# Altium schematic sheet WallLightRemote_V1.0_HMI.SchDoc: WallLight Remote
size A4; PageSetup: Record=PageOptions|CenterHorizontal=True|CenterVertical=True|PrintScale=0.97|XCorrection=1.00|YCorrection=1.00|PrintKind=0|BorderSize=5000000|LeftOffset=0|BottomOffset=0|Orientation=2|PaperLength=1000|PaperWidth=1000|Scale=100|PaperSource=7|PrintQuality=-3|MediaType=1|DitherType=10|PrintScaleMode=1|PaperKind=A4|PaperIndex=9; Organization: Crelin; Address1: Karl-Neuhaus-Strasse 6, 2502 Biel; Address2: Florian Baumgartner; Address3: florian.b-h@bluewin.ch; Address4: Tel: (+41) 32-323 56 25 / (+41) 79-502 92 10; DocumentNumber: HMI; Revision: V1.0; SheetNumber: 5; SheetTotal: 5; Author: Florian Baumgartner
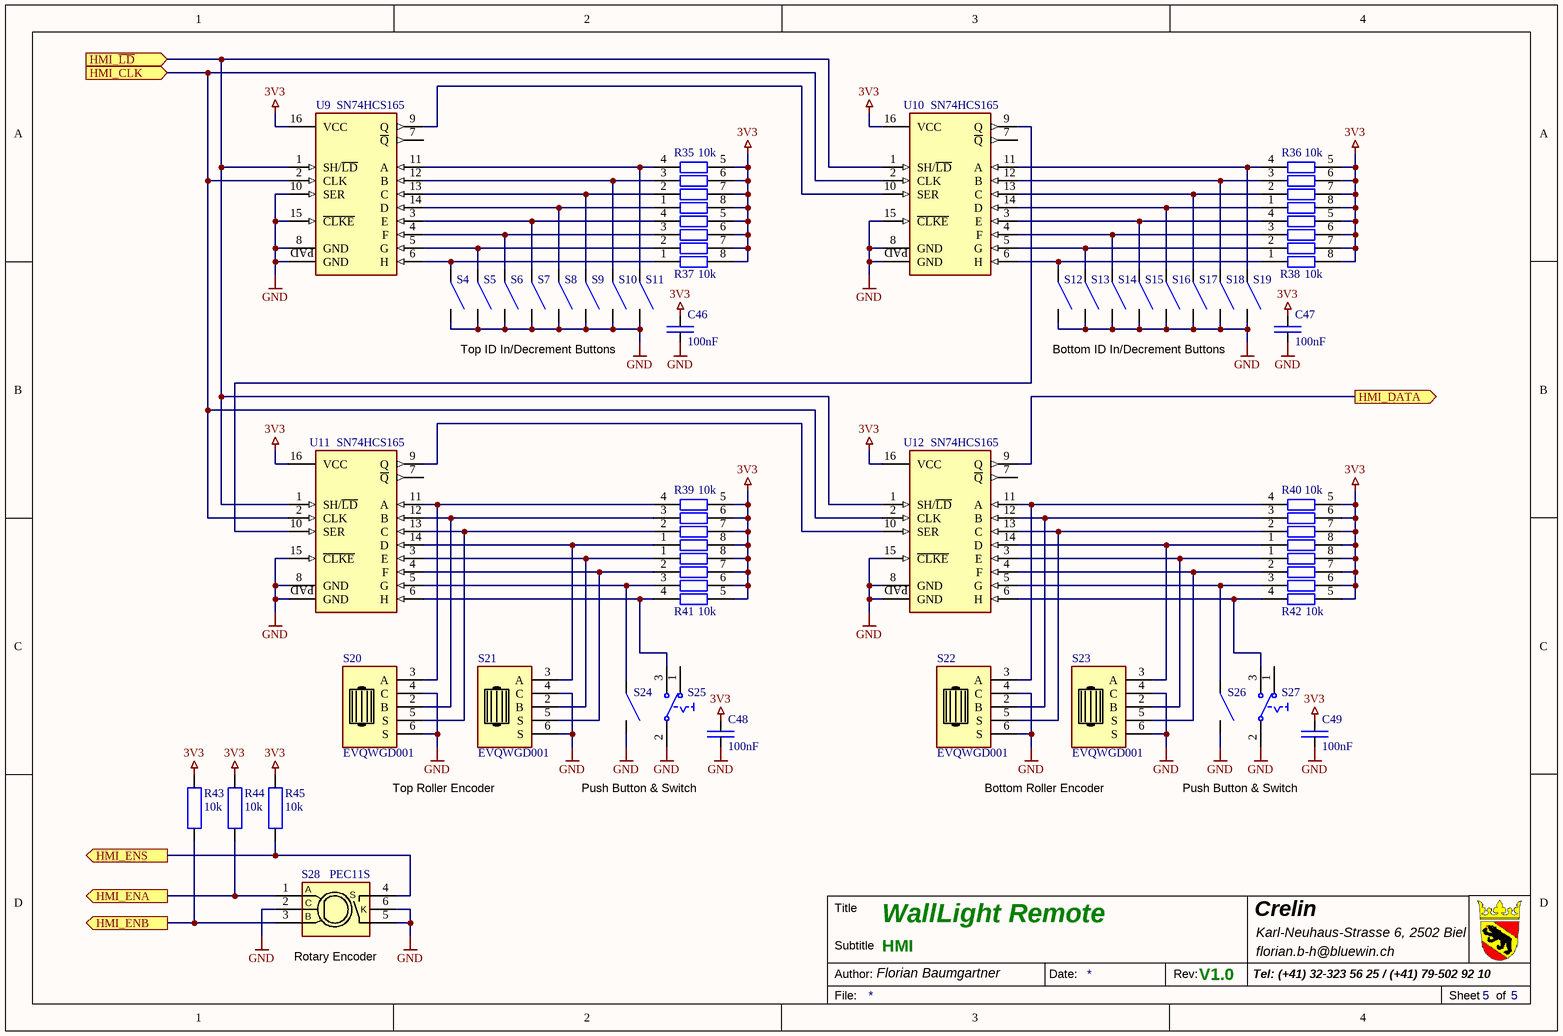
[diagram p0: WallLightRemote_V1.0_HMI.SchDoc]

## Parts
C46  100nF  [SMD Keramikkondensator 0603]
C47  100nF  [SMD Keramikkondensator 0603]
C48  100nF  [SMD Keramikkondensator 0603]
C49  100nF  [SMD Keramikkondensator 0603]
R35  10k  [SMD Widerstand Array 4-Fach 0603]
R36  10k  [SMD Widerstand Array 4-Fach 0603]
R37  10k  [SMD Widerstand Array 4-Fach 0603]
R38  10k  [SMD Widerstand Array 4-Fach 0603]
R39  10k  [SMD Widerstand Array 4-Fach 0603]
R40  10k  [SMD Widerstand Array 4-Fach 0603]
R41  10k  [SMD Widerstand Array 4-Fach 0603]
R42  10k  [SMD Widerstand Array 4-Fach 0603]
R43  10k  [SMD Widerstand 0603]
R44  10k  [SMD Widerstand 0603]
R45  10k  [SMD Widerstand 0603]
S4  SMD-Button  [SMD Button 6.5x6.0x2.5]  (value not drawn)
S5  SMD-Button  [SMD Button 6.5x6.0x2.5]  (value not drawn)
S6  SMD-Button  [SMD Button 6.5x6.0x2.5]  (value not drawn)
S7  SMD-Button  [SMD Button 6.5x6.0x2.5]  (value not drawn)
S8  SMD-Button  [SMD Button 6.5x6.0x2.5]  (value not drawn)
S9  SMD-Button  [SMD Button 6.5x6.0x2.5]  (value not drawn)
S10  SMD-Button  [SMD Button 6.5x6.0x2.5]  (value not drawn)
S11  SMD-Button  [SMD Button 6.5x6.0x2.5]  (value not drawn)
S12  SMD-Button  [SMD Button 6.5x6.0x2.5]  (value not drawn)
S13  SMD-Button  [SMD Button 6.5x6.0x2.5]  (value not drawn)
S14  SMD-Button  [SMD Button 6.5x6.0x2.5]  (value not drawn)
S15  SMD-Button  [SMD Button 6.5x6.0x2.5]  (value not drawn)
S16  SMD-Button  [SMD Button 6.5x6.0x2.5]  (value not drawn)
S17  SMD-Button  [SMD Button 6.5x6.0x2.5]  (value not drawn)
S18  SMD-Button  [SMD Button 6.5x6.0x2.5]  (value not drawn)
S19  SMD-Button  [SMD Button 6.5x6.0x2.5]  (value not drawn)
S20  EVQWGD001  [THT Roller Encoder (EVQWGD001)]
S21  EVQWGD001  [THT Roller Encoder (EVQWGD001)]
S22  EVQWGD001  [THT Roller Encoder (EVQWGD001)]
S23  EVQWGD001  [THT Roller Encoder (EVQWGD001)]
S24  SMD-Button  [SMD Button 12.0x12.0x7.5]  (value not drawn)
S25  SS-12M11G5  [THT Slide Switch (MS12ANG03)]  (value not drawn)
S26  SMD-Button  [SMD Button 12.0x12.0x7.5]  (value not drawn)
S27  SS-12M11G5  [THT Slide Switch (MS12ANG03)]  (value not drawn)
S28  PEC11S  [SMD Rotary Encoder with Switch]
U9  SN74HCS165  [SMD IC WQFN-16 (3.5x2.5)]
U10  SN74HCS165  [SMD IC WQFN-16 (3.5x2.5)]
U11  SN74HCS165  [SMD IC WQFN-16 (3.5x2.5)]
U12  SN74HCS165  [SMD IC WQFN-16 (3.5x2.5)]

## Ports
HMI_CLK (in), HMI_DATA (out), HMI_ENA (out), HMI_ENB (out), HMI_ENS (out), HMI_~{LD} (in)

## Nets
3V3: C46.2 C47.2 C48.2 C49.2 R35.5 R35.6 R35.7 R35.8 R36.5 R36.6 R36.7 R36.8 R37.5 R37.6 R37.7 R37.8 R38.5 R38.6 R38.7 R38.8 R39.5 R39.6 R39.7 R39.8 R40.5 R40.6 R40.7 R40.8 R41.5 R41.6 R41.7 R41.8 R42.5 R42.6 R42.7 R42.8 R43.2 R44.2 R45.2 U9.16(VCC) U10.16(VCC) U11.16(VCC) U12.16(VCC)
GND: C46.1 C47.1 C48.1 C49.1 S4.2 S5.2 S6.2 S7.2 S8.2 S9.2 S10.2 S11.2 S12.2 S13.2 S14.2 S15.2 S16.2 S17.2 S18.2 S19.2 S20.4(C) S20.6(S) S21.4(C) S21.6(S) S22.4(C) S22.6(S) S23.4(C) S23.6(S) S24.2 S25.2(COMMON1) S26.2 S27.2(COMMON1) S28.2(C) S28.5(S) S28.6(K) U9.8(GND) U9.10(SER) U9.15(~{CLKE}) U9.PAD(GND) U10.8(GND) U10.15(~{CLKE}) U10.PAD(GND) U11.8(GND) U11.15(~{CLKE}) U11.PAD(GND) U12.8(GND) U12.15(~{CLKE}) U12.PAD(GND)
HMI_CLK: U9.2(CLK) U10.2(CLK) U11.2(CLK) U12.2(CLK) ; port HMI_CLK
HMI_DATA: U12.9(Q) ; port HMI_DATA
HMI_ENA: R44.1 S28.1(A) ; port HMI_ENA
HMI_ENB: R43.1 S28.3(B) ; port HMI_ENB
HMI_ENS: R45.1 S28.4(S) ; port HMI_ENS
HMI_~{LD}: U9.1(SH/~{LD}) U10.1(SH/~{LD}) U11.1(SH/~{LD}) U12.1(SH/~{LD}) ; port HMI_~{LD}
NetR35_1: R35.1 S8.1 U9.14(D)
NetR35_2: R35.2 S9.1 U9.13(C)
NetR35_3: R35.3 S10.1 U9.12(B)
NetR35_4: R35.4 S11.1 U9.11(A)
NetR36_1: R36.1 S16.1 U10.14(D)
NetR36_2: R36.2 S17.1 U10.13(C)
NetR36_3: R36.3 S18.1 U10.12(B)
NetR36_4: R36.4 S19.1 U10.11(A)
NetR37_1: R37.1 S4.1 U9.6(H)
NetR37_2: R37.2 S5.1 U9.5(G)
NetR37_3: R37.3 S6.1 U9.4(F)
NetR37_4: R37.4 S7.1 U9.3(E)
NetR38_1: R38.1 S12.1 U10.6(H)
NetR38_2: R38.2 S13.1 U10.5(G)
NetR38_3: R38.3 S14.1 U10.4(F)
NetR38_4: R38.4 S15.1 U10.3(E)
NetR39_1: R39.1 S21.3(A) U11.14(D)
NetR39_2: R39.2 S20.5(S) U11.13(C)
NetR39_3: R39.3 S20.2(B) U11.12(B)
NetR39_4: R39.4 S20.3(A) U11.11(A)
NetR40_1: R40.1 S23.3(A) U12.14(D)
NetR40_2: R40.2 S22.5(S) U12.13(C)
NetR40_3: R40.3 S22.2(B) U12.12(B)
NetR40_4: R40.4 S22.3(A) U12.11(A)
NetR41_1: R41.1 S21.2(B) U11.3(E)
NetR41_2: R41.2 S21.5(S) U11.4(F)
NetR41_3: R41.3 S24.1 U11.5(G)
NetR41_4: R41.4 S25.3(NO1) U11.6(H)
NetR42_1: R42.1 S23.2(B) U12.3(E)
NetR42_2: R42.2 S23.5(S) U12.4(F)
NetR42_3: R42.3 S26.1 U12.5(G)
NetR42_4: R42.4 S27.3(NO1) U12.6(H)
NetU9_9: U9.9(Q) U10.10(SER)
NetU10_9: U10.9(Q) U11.10(SER)
NetU11_9: U11.9(Q) U12.10(SER)

Not connected (* = marked no-connect by the designer): S20 1(NC); S21 1(NC); S22 1(NC); S23 1(NC); S25 1(NC1); S27 1(NC1); U9 7(~{Q}); U10 7(~{Q}); U11 7(~{Q}); U12 7(~{Q})

## Notes on the sheet
- Top ID In/Decrement Buttons
- Bottom ID In/Decrement Buttons
- Top Roller Encoder
- Push Button & Switch
- Bottom Roller Encoder
- (near S28) Rotary Encoder
- Title
- Crelin
- Author:
- Subtitle
- Date:
- Rev:
- File:
- Sheet
- of

## Library data of the parts
C46-C49 = E6 - 100nF: SMD Ceramic Capacitor E6; Component Value: 100nF 50V; Component Description: Multilayer Ceramic Capacitors MLCC; ComponentLink1Description: Datasheet; ComponentLink1URL: https://datasheet.lcsc.com/lcsc/1809301912_YAGEO-CC0603KRX7R9BB104_C14663.pdf; Digikey: 445-6899-1-ND; Farnell: 2210822; JLC-Parts: C14663; Mouser: 810-CGA2B3X7R1H104K; Unit Price: 0.01
R35-R42 = R-Array Single Quad E24 - 10k: Isolated Resistor Array; Component Value: 10k (4x, 50V, 62.5mW, 5%); ComponentLink1Description: Datasheet; ComponentLink1URL: https://datasheet.lcsc.com/lcsc/1810191515_UNI-ROYAL-Uniroyal-Elec-4D03WGJ0103T5E_C29718.pdf; Digikey: Y4103CT-ND; Farnell: 2060167; JLC-Parts: C29718; Mouser: 667-EXB-V8V103JV; Unit Price: 0.01; Component Description: Isolated Resistor Array
R43-R45 = R-RESISTOR: RES (E=Heizwiderstand B=Messwandler); Component Description: Thick Film Chip Resistor; Component Value: 10k (75V, 100mW, 1%); Digikey: P10.0KHCT-ND; Farnell: 2303192; Mouser: 667-ERJ-3EKF1002V; JLC-Parts: C25804; Unit Price: 0.01
S4-S19 = Button 3mmx2.5mm: Button SPST; Component Value: EVQQ2U02W; Component Description: Tactile Switch; Digikey: P12954SCT-ND; ComponentLink1Description: Datasheet; ComponentLink1URL: https://datasheet.lcsc.com/lcsc/1912111437_PANASONIC-EVQQ2U02W_C395227.pdf; Farnell: 2860932; JLC-Parts: C395227; Mouser: 667-EVQ-Q2U02W; Unit Price: 0.19
S20-S23 = S-EVQWGD001: Axial Roller Encoder; aliExpress: 1005004320540116; Component Description: Axial Roller Encoder; ComponentLink1Description: Datasheet; Component Value: EVQWGD001; Unit Price: 4.80
S24 S26 = Button 3mmx2.5mm: Button SPST; Component Value: TS-1003S-07026; Component Description: Tactile Switch; Digikey: 2223-TS16-1212-75-BK-160-SMT-TRDKR-ND; ComponentLink1Description: Datasheet; JLC-Parts: C455223; Mouser: 179-TS16121275160STT; Unit Price: 0.06
  S24: ComponentLink1URL: https://datasheet.lcsc.com/lcsc/1912111437_XUNPU-TS-1003S-07026_C455223.pdf
  S26: ComponentLink1URL: https://datasheet.lcsc.com/lcsc/1912111437_PANASONIC-EVQQ2U02W_C395227.pdf
S25 S27 = S-PCM12SMTR: Vertical Slide Switch SPDT; Component Value: SS-12D10-G050; Digikey: 360-2383-ND; Mouser: 633-MS12ANG03; ComponentLink1Description: Datasheet; JLC-Parts: C2848933; Component Description: Vertical Slide Switch SPDT; Unit Price: 0.23
  S25: ComponentLink1URL: https://datasheet.lcsc.com/lcsc/2207061130_G-Switch-SS-12D10-G050_C2848933.pdf
S28 = S-Rotary Encoder: Rotary Encoder; Component Description: Rotary Encoder with Switch; Component Value: PEC11S-929K-S0015 (15PPR, 0.5mm); Digikey: PEC11S-929K-S0015-ND; Farnell: 2813728; Mouser: 652-PEC11S929K-S0015; Unit Price: 2.64
U9-U12 = U-SN74HCS165: 8-Bit Paralell-In Shift Register (Schmitt Trigger); ComponentLink1Description: Datasheet; ComponentLink1URL: https://www.ti.com/lit/ds/symlink/sn74hcs165.pdf; Digikey: 296-SN74HCS165BQBRDKR-ND; Component Value: SN74HCS165; JLC-Parts: C2866439; Mouser: 595-SN74HCS165BQBR; Unit Price: 0.43; Component Description: 8-Bit Paralell-In Shift Register (Schmitt Trigger)